# Altium project stm_effen_psb_controller.PrjPCB
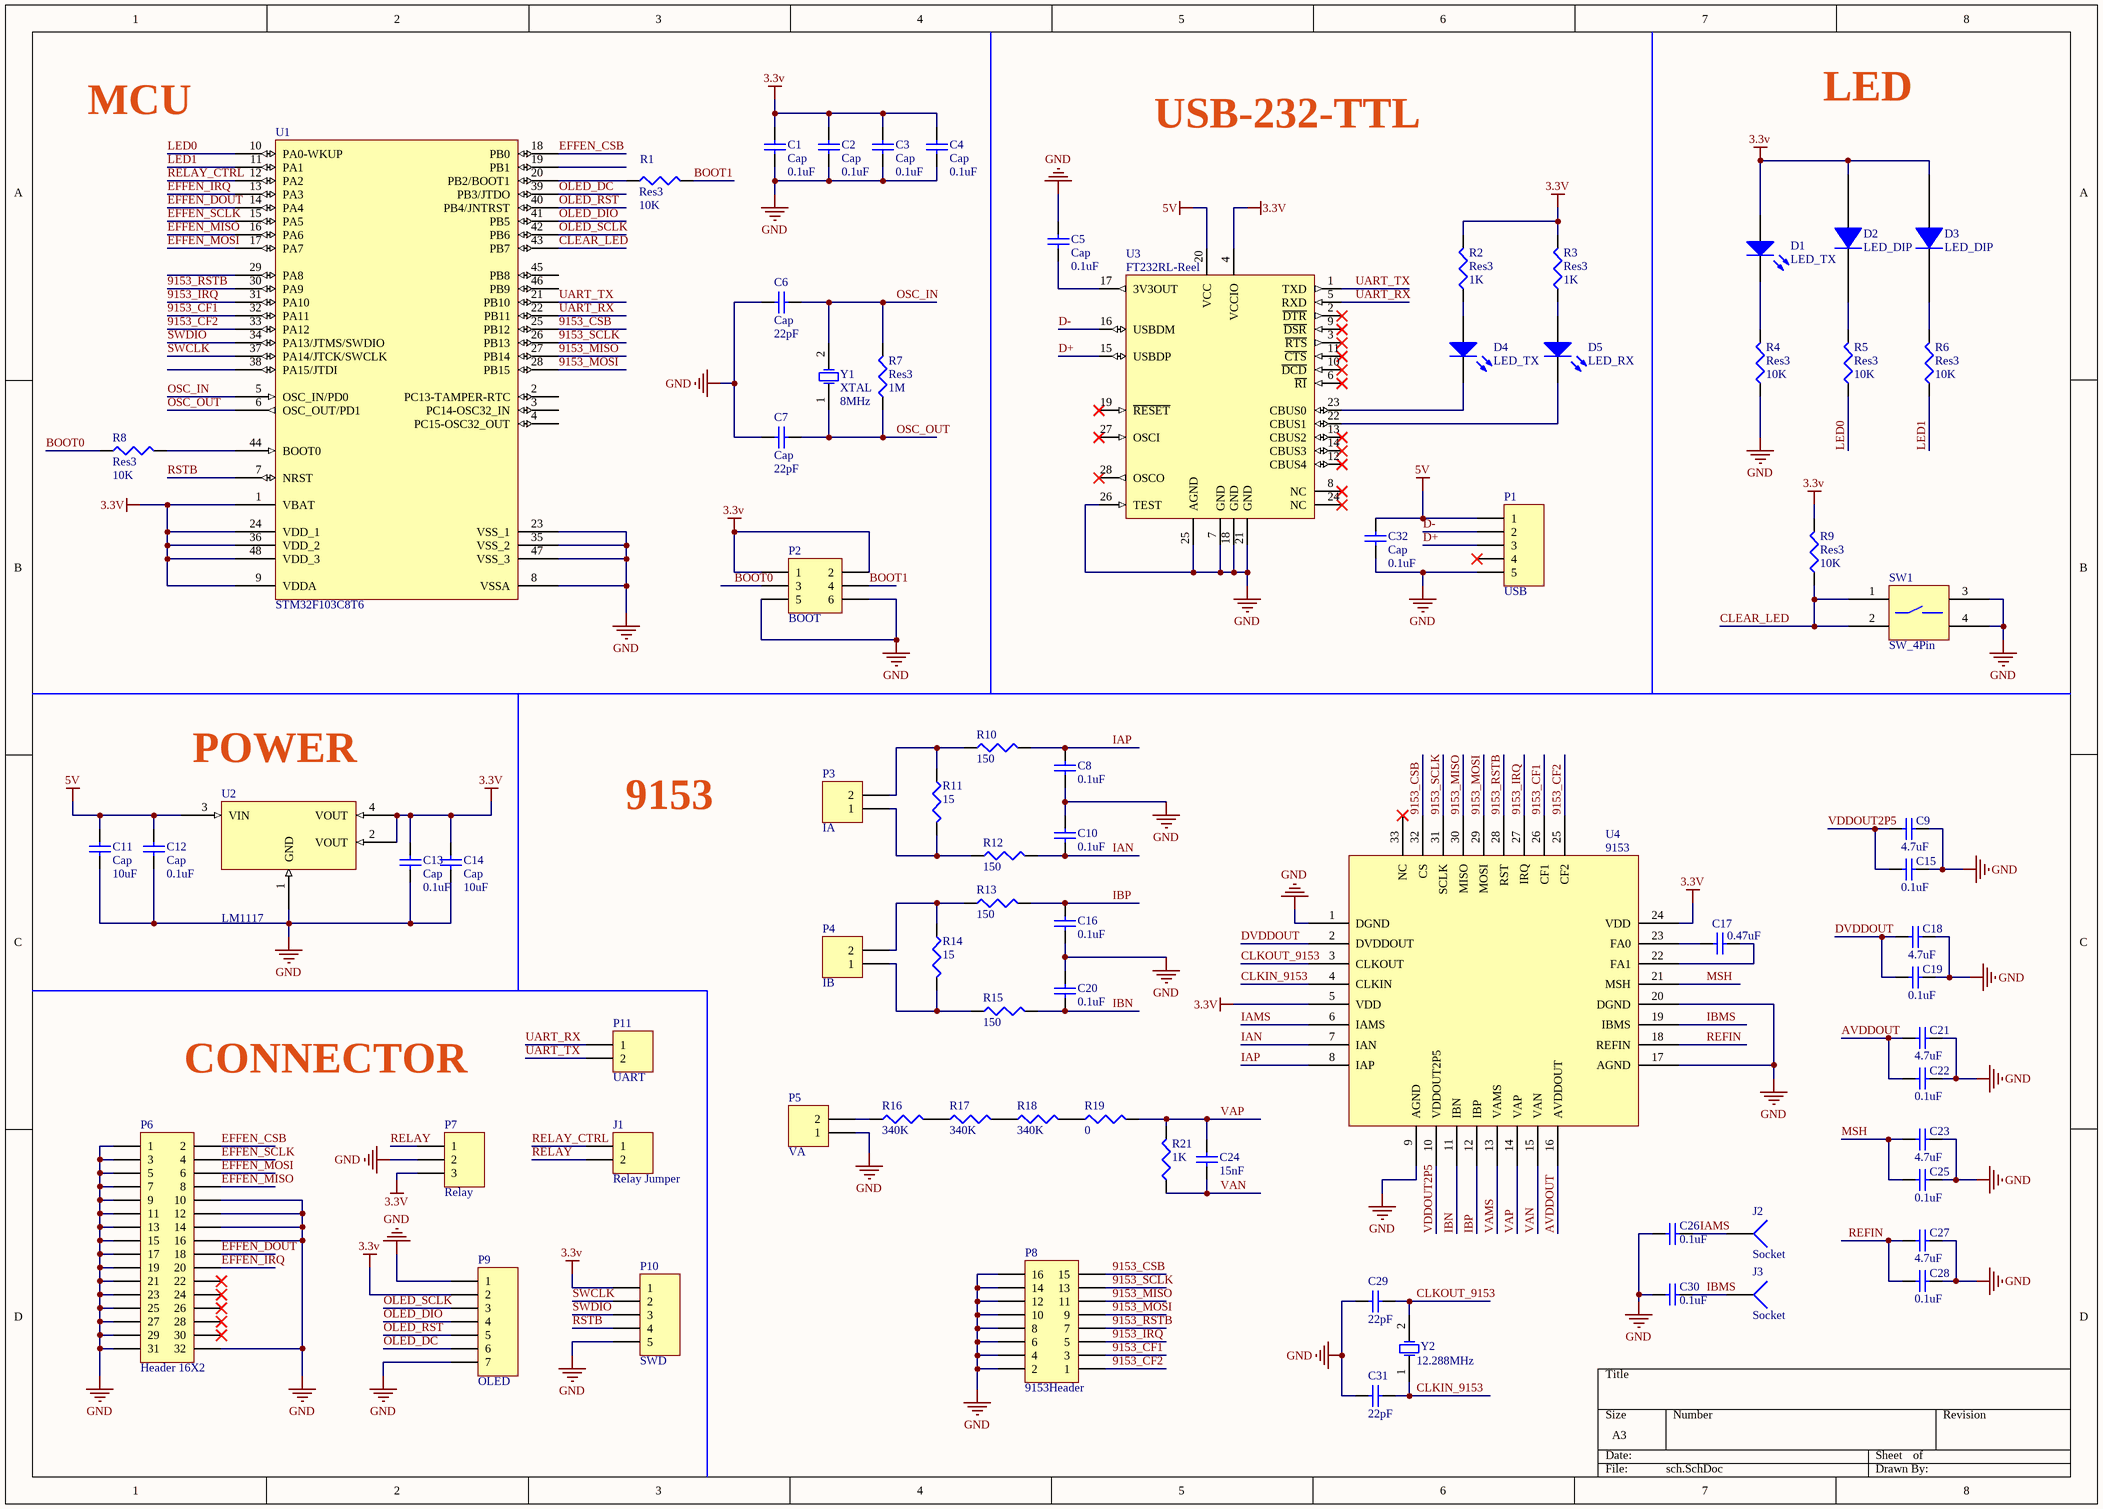
[diagram p0: sch.SchDoc]
1 sheet, 78 parts. Net scope: global (net labels, ports and power ports of the same name join across sheets).
Board file: layout.PcbDoc

## Sheet sch.SchDoc
size A3

### Parts
C1  Cap  value 0.1uF  [6-0805_M]
C2  Cap  value 0.1uF  [6-0805_M]
C3  Cap  value 0.1uF  [6-0805_M]
C4  Cap  value 0.1uF  [6-0805_M]
C5  Cap  value 0.1uF  [6-0805_M]
C6  Cap  value 22pF  [6-0805_M]
C7  Cap  value 22pF  [6-0805_M]
C8  value 0.1uF  [1206_ROY]  (hidden comment: Cap)
C9  value 4.7uF  [6-0805_M]  (hidden comment: Cap)
C10  value 0.1uF  [1206_ROY]  (hidden comment: Cap)
C11  Cap  value 10uF  [6-0805_M]
C12  Cap  value 0.1uF  [6-0805_M]
C13  Cap  value 0.1uF  [6-0805_M]
C14  Cap  value 10uF  [6-0805_M]
C15  value 0.1uF  [6-0805_M]  (hidden comment: Cap)
C16  value 0.1uF  [1206_ROY]  (hidden comment: Cap)
C17  value 0.47uF  [6-0805_M]  (hidden comment: Cap)
C18  value 4.7uF  [6-0805_M]  (hidden comment: Cap)
C19  value 0.1uF  [6-0805_M]  (hidden comment: Cap)
C20  value 0.1uF  [1206_ROY]  (hidden comment: Cap)
C21  value 4.7uF  [6-0805_M]  (hidden comment: Cap)
C22  value 0.1uF  [6-0805_M]  (hidden comment: Cap)
C23  value 4.7uF  [6-0805_M]  (hidden comment: Cap)
C24  value 15nF  [6-0805_M]  (hidden comment: Cap)
C25  value 0.1uF  [6-0805_M]  (hidden comment: Cap)
C26  value 0.1uF  [6-0805_M]  (hidden comment: Cap)
C27  value 4.7uF  [6-0805_M]  (hidden comment: Cap)
C28  value 0.1uF  [6-0805_M]  (hidden comment: Cap)
C29  value 22pF  [6-0805_M]  (hidden comment: Cap)
C30  value 0.1uF  [6-0805_M]  (hidden comment: Cap)
C31  value 22pF  [6-0805_M]  (hidden comment: Cap)
C32  Cap  value 0.1uF  [6-0805_M]
D1  LED_TX  [6-0805_M]
D2  LED_DIP  [LED_3mm]
D3  LED_DIP  [LED_3mm]
D4  LED_TX  [6-0805_M]
D5  LED_RX  [6-0805_M]
J1  Relay Jumper  [HDR1X2]
J2  Socket  [PIN1]
J3  Socket  [PIN1]
P1  USB  [mini_USB]
P2  BOOT  [HDR2X3]
P3  IA  [KF127-0.5-2]
P4  IB  [KF127-0.5-2]
P5  VA  [KF127-0.5-2]
P6  Header 16X2  [HDR2X16]
P7  Relay  [KF127-0.5-3]
P8  9153Header  [HDR2X8]
P9  OLED  [HDR1X7]
P10  SWD  [HDR1X5]
P11  UART  [HDR1X2]
R1  Res3  value 10K  [6-0805_M]
R2  Res3  value 1K  [6-0805_M]
R3  Res3  value 1K  [6-0805_M]
R4  Res3  value 10K  [6-0805_M]
R5  Res3  value 10K  [6-0805_M]
R6  Res3  value 10K  [6-0805_M]
R7  Res3  value 1M  [6-0805_M]
R8  Res3  value 10K  [6-0805_M]
R9  Res3  value 10K  [6-0805_M]
R10  value 150  [6-0805_M]  (hidden comment: Res3)
R11  value 15  [6-0805_M]  (hidden comment: Res3)
R12  value 150  [6-0805_M]  (hidden comment: Res3)
R13  value 150  [6-0805_M]  (hidden comment: Res3)
R14  value 15  [6-0805_M]  (hidden comment: Res3)
R15  value 150  [6-0805_M]  (hidden comment: Res3)
R16  value 340K  [1206_ROY]  (hidden comment: Res3)
R17  value 340K  [1206_ROY]  (hidden comment: Res3)
R18  value 340K  [1206_ROY]  (hidden comment: Res3)
R19  value 0  [1206_ROY]  (hidden comment: Res3)
R21  value 1K  [1206_ROY]  (hidden comment: Res3)
SW1  SW_4Pin  [SW_4]
U1  STM32F103C8T6  [LQFP48_N]
U2  LM1117  [SOT223-4L]
U3  FT232RL-Reel  [SSOP-28_N]
U4  9153  [LFCSP_32]
Y1  XTAL  value 8MHz  [XTAL_SMT]
Y2  value 12.288MHz  [XTAL_SMT]  (hidden comment: XTAL)

### Nets
3.3V: C1.2 C2.2 C3.2 C4.2 C13.2 C14.2 D1.1(A) D2.1(Pos) D3.1(Pos) P2.1 P2.2 P7.3 P9.2 P10.1 R2.2 R3.2 R9.2 U1.1(VBAT) U1.9(VDDA) U1.24(VDD_1) U1.36(VDD_2) U1.48(VDD_3) U2.2(VOUT) U2.4(VOUT) U3.4(VCCIO) U4.5(VDD) U4.24(VDD)
5V: C11.2 C12.2 C32.2 P1.1 U2.3(VIN) U3.20(VCC)
GND: C1.1 C2.1 C3.1 C4.1 C5.2 C6.2 C7.2 C8.2 C9.2 C10.1 C11.1 C12.1 C13.1 C14.1 C15.2 C16.2 C18.2 C19.2 C20.1 C21.2 C22.2 C23.2 C25.2 C26.2 C27.2 C28.2 C29.2 C30.2 C31.2 C32.1 P1.5 P2.5 P2.6 P5.1 P6.1 P6.3 P6.5 P6.7 P6.9 P6.10 P6.11 P6.12 P6.13 P6.14 P6.15 P6.16 P6.17 P6.19 P6.21 P6.23 P6.25 P6.27 P6.29 P6.31 P6.32 P7.2 P8.2 P8.4 P8.6 P8.8 P8.10 P8.12 P8.14 P8.16 P9.1 P9.7 P10.5 R4.1 SW1.3 SW1.4 U1.8(VSSA) U1.23(VSS_1) U1.35(VSS_2) U1.47(VSS_3) U2.1(GND) U3.7(GND) U3.18(GND) U3.21(GND) U3.25(AGND) U3.26(TEST) U4.1(DGND) U4.9(AGND) U4.17(AGND) U4.20(DGND)
9153_CF1: P8.3 U1.32(PA11) U4.26(CF1)
9153_CF2: P8.1 U1.33(PA12) U4.25(CF2)
9153_CSB: P8.15 U1.25(PB12) U4.32(CS)
9153_IRQ: P8.5 U1.31(PA10) U4.27(IRQ)
9153_MISO: P8.11 U1.27(PB14) U4.30(MISO)
9153_MOSI: P8.9 U1.28(PB15) U4.29(MOSI)
9153_RSTB: P8.7 U1.30(PA9) U4.28(RST)
9153_SCLK: P8.13 U1.26(PB13) U4.31(SCLK)
AVDDOUT: C21.1 C22.1 U4.16(AVDDOUT)
BOOT0: P2.3 R8.1
BOOT1: P2.4 R1.2
CLEAR_LED: R9.1 SW1.1 SW1.2 U1.43(PB7)
CLKIN_9153: C31.1 U4.4(CLKIN) Y2.1(OSC1)
CLKOUT_9153: C29.1 U4.3(CLKOUT) Y2.2(OSC2)
D+: P1.3 U3.15(USBDP)
D-: P1.2 U3.16(USBDM)
DVDDOUT: C18.1 C19.1 U4.2(DVDDOUT)
EFFEN_CSB: P6.2 U1.18(PB0)
EFFEN_DOUT: P6.18 U1.14(PA4)
EFFEN_IRQ: P6.20 U1.13(PA3)
EFFEN_MISO: P6.8 U1.16(PA6)
EFFEN_MOSI: P6.6 U1.17(PA7)
EFFEN_SCLK: P6.4 U1.15(PA5)
IAMS: C26.1 J2.1 U4.6(IAMS)
IAN: C10.2 R12.2 U4.7(IAN)
IAP: C8.1 R10.2 U4.8(IAP)
IBMS: C30.1 J3.1 U4.19(IBMS)
IBN: C20.2 R15.2 U4.11(IBN)
IBP: C16.1 R13.2 U4.12(IBP)
LED0: R5.1 U1.10(PA0-WKUP)
LED1: R6.1 U1.11(PA1)
MSH: C23.1 C25.1 U4.21(MSH)
OLED_DC: P9.6 U1.39(PB3/JTDO)
OLED_DIO: P9.4 U1.41(PB5)
OLED_RST: P9.5 U1.40(PB4/JNTRST)
OLED_SCLK: P9.3 U1.42(PB6)
OSC_IN: C6.1 R7.2 U1.5(OSC_IN/PD0) Y1.2(OSC2)
OSC_OUT: C7.1 R7.1 U1.6(OSC_OUT/PD1) Y1.1(OSC1)
REFIN: C27.1 C28.1 U4.18(REFIN)
RELAY: J1.2 P7.1
RELAY_CTRL: J1.1 U1.12(PA2)
RSTB: P10.4 U1.7(NRST)
SWCLK: P10.2 U1.37(PA14/JTCK/SWCLK)
SWDIO: P10.3 U1.34(PA13/JTMS/SWDIO)
UART_RX: P11.1 U1.22(PB11) U3.5(RXD)
UART_TX: P11.2 U1.21(PB10) U3.1(TXD)
VAMS: U4.13(VAMS)
VAN: C24.2 R21.1 U4.15(VAN)
VAP: C24.1 R19.2 R21.2 U4.14(VAP)
VDDOUT2P5: C9.1 C15.1 U4.10(VDDOUT2P5)
NetC5_1: C5.1 U3.17(3V3OUT)
NetC17_1: C17.1 U4.23(FA0)
NetC17_2: C17.2 U4.22(FA1)
NetD1_2: D1.2(K) R4.2
NetD2_2: D2.2(Neg) R5.2
NetD3_2: D3.2(Neg) R6.2
NetD4_1: D4.1(A) R2.1
NetD4_2: D4.2(K) U3.23(CBUS0)
NetD5_1: D5.1(A) R3.1
NetD5_2: D5.2(K) U3.22(CBUS1)
NetP3_1: P3.1 R11.2 R12.1
NetP3_2: P3.2 R10.1 R11.1
NetP4_1: P4.1 R14.2 R15.1
NetP4_2: P4.2 R13.1 R14.1
NetP5_2: P5.2 R16.1
NetR1_1: R1.1 U1.20(PB2/BOOT1)
NetR8_2: R8.2 U1.44(BOOT0)
NetR16_2: R16.2 R17.1
NetR17_2: R17.2 R18.1
NetR18_2: R18.2 R19.1

Not connected (* = marked no-connect by the designer): P1 4*; P6 22* 24* 26* 28* 30*; U1 2(PC13-TAMPER-RTC) 3(PC14-OSC32_IN) 4(PC15-OSC32_OUT) 19(PB1) 29(PA8) 38(PA15/JTDI) 45(PB8) 46(PB9); U3 2(~{DTR})* 3(~{RTS})* 6(~{RI})* 8(NC)* 9(~{DSR})* 10(~{DCD})* 11(~{CTS})* 12(CBUS4)* 13(CBUS2)* 14(CBUS3)* 19(~{RESET})* 24(NC)* 27(OSCI)* 28(OSCO)*; U4 33(NC)*

### Notes on the sheet
- LED
- MCU
- USB-232-TTL
- (near U2) POWER
- 9153
- CONNECTOR

### Library data of the parts
C1-C32 = Cap: Capacitor; Published: 8-Jun-2000; LatestRevisionDate: 17-Jul-2002; LatestRevisionNote: Re-released for DXP Platform.; PackageReference: RAD-0.3; Publisher: Altium Limited; PackageDescription: Radial Cap, Thru-Hole; 2 Leads; 0.3 in Pin Spacing
D1 D4 D5 = LED0: Typical INFRARED GaAs LED; Published: 8-Jun-2000; LatestRevisionDate: 08-Jul-2005; LatestRevisionNote: Mech Layer 1 removed.; PackageReference: LED-0; Publisher: Altium Limited; PackageDescription: LED; 2 Leads
D2 D3 = LED_3mm
J1 P3-P5 P11 = Header 2: Header, 2-Pin; LatestRevisionDate: 17-Jul-2002; LatestRevisionNote: Re-released for DXP Platform.; Publisher: Altium Limited
P1 P10 = Header 5: Header, 5-Pin; LatestRevisionDate: 17-Jul-2002; LatestRevisionNote: Re-released for DXP Platform.; Publisher: Altium Limited
P2 = Header 3X2: Header, 3-Pin, Dual row; LatestRevisionDate: 17-Jul-2002; LatestRevisionNote: Re-released for DXP Platform.; Publisher: Altium Limited
P6 = Header 16X2: Header, 16-Pin, Dual row; LatestRevisionDate: 17-Jul-2002; LatestRevisionNote: Re-released for DXP Platform.; Publisher: Altium Limited
P7 = Header 3: Header, 3-Pin; LatestRevisionDate: 17-Jul-2002; LatestRevisionNote: Re-released for DXP Platform.; Publisher: Altium Limited
P8 = Header 8X2: Header, 8-Pin, Dual row; LatestRevisionDate: 17-Jul-2002; LatestRevisionNote: Re-released for DXP Platform.; Publisher: Altium Limited
P9 = Header 7: Header, 7-Pin; LatestRevisionDate: 17-Jul-2002; LatestRevisionNote: Re-released for DXP Platform.; Publisher: Altium Limited
R1-R19 R21 = Res3: Resistor; Published: 8-Jun-2000; LatestRevisionDate: 29-May-2009; LatestRevisionNote: IPC-7351 Footprint Added.; PackageReference: J1-0603; Publisher: Altium Limited; PackageDescription: Chip Resistor
U1 = STM32F103C8T6: STM32 ARM-based 32-bit MCU with 64 Kbytes Flash, 48-pin LQFP, Industrial Temperature; Published: 30-May-2008; DatasheetVersion: rev6, Mar-2008; PackageVersion: Mar-2008; PackageReference: LQFP48; Publisher: Altium Limited; PackageDescription: 48-Pin Low-Profile Quad Flat Pack, 7 x 7 mm Body, 0.5 mm Pitch (LQFP48); ComponentLink1Description: Manufacturer Link; ComponentLink1URL: www.st.com/stm32; ComponentLink2Description: Datasheet; ComponentLink2URL: http://www.st.com/stonline/products/literature/ds/13587.pdf
U3 = FT232RL-Reel: USB UART Asynchronous Serial Data Transfer Chip, SSOP-28, Tape and Reel; Published: 19-Aug-2010; DatasheetVersion: ver 2.07, Jul-2010; PackageVersion: 2010; PackageReference: SSOP-28; Publisher: Altium Limited; PackageDescription: 28-Pin Small Outline Package 0.65 mm Pitch; ComponentLink1Description: Manufacturer Link; ComponentLink1URL: http://www.ftdichip.com/Products/ICs/FT232R.htm; ComponentLink2Description: Datasheet; ComponentLink2URL: http://www.ftdichip.com/Support/Documents/DataSheets/ICs/DS_FT232R.pdf
Y1 Y2 = XTAL: Crystal Oscillator; Published: 8-Jun-2000; LatestRevisionDate: 17-Jul-2002; LatestRevisionNote: Re-released for DXP Platform.; PackageReference: R38; Publisher: Altium Limited; PackageDescription: Crystal, Thru-Hole; 2 Leads; Body 3.1 x 8.2 mm (Dia.xH)
J2 J3 = Socket: LatestRevisionDate: 17-Jul-2002; LatestRevisionNote: Re-released for DXP Platform.; Publisher: Altium Limited